# Altium schematic sheet COMM Circuitry.SchDoc
size A4; SheetNumber: 5; SheetTotal: 6
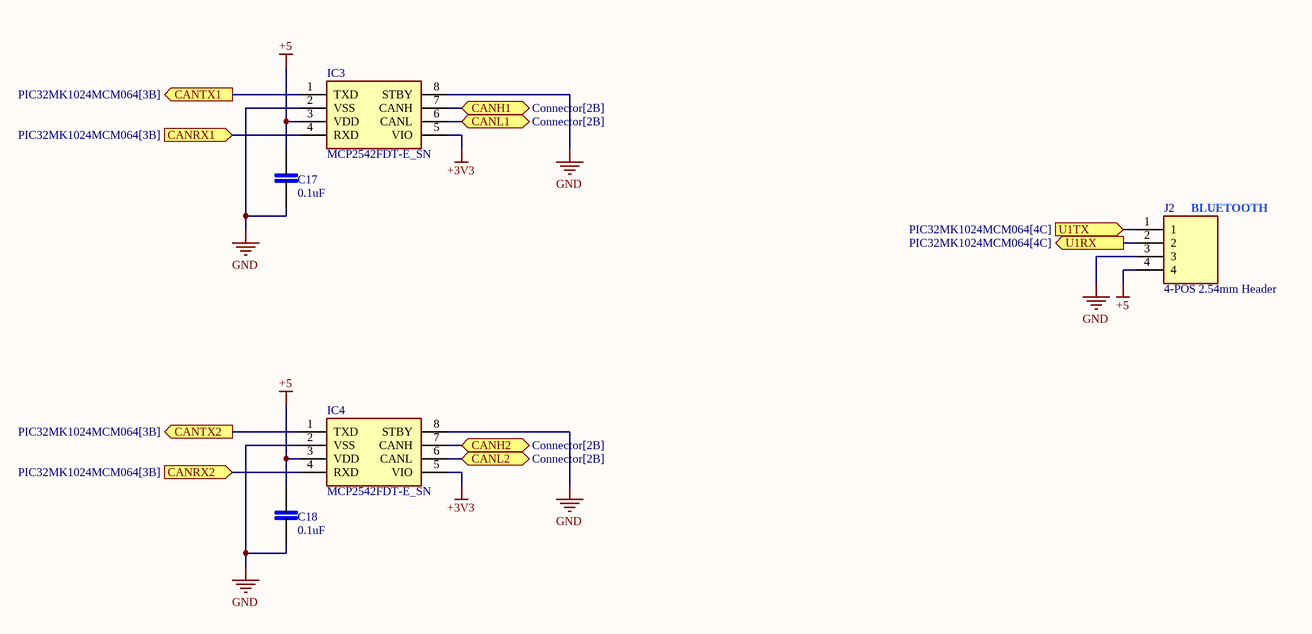
[diagram p0: COMM Circuitry.SchDoc]

## Parts
C17  0.1uF  [0805]
C18  0.1uF  [0805]
IC3  MCP2542FDT-E_SN  [MCP2542FDT-E_SN]
IC4  MCP2542FDT-E_SN  [MCP2542FDT-E_SN]
J2  4-POS 2.54mm Header  [4-POS 2.54mm Header]

## Ports
CANH1 (bidir, see Connector[2B]), CANH2 (bidir, see Connector[2B]), CANL1 (bidir, see Connector[2B]), CANL2 (bidir, see Connector[2B]), CANRX1 (in, see PIC32MK1024MCM064[3B]), CANRX2 (in, see PIC32MK1024MCM064[3B]), CANTX1 (out, see PIC32MK1024MCM064[3B]), CANTX2 (out, see PIC32MK1024MCM064[3B]), U1RX (out, see PIC32MK1024MCM064[4C]), U1TX (in, see PIC32MK1024MCM064[4C])

## Nets
+3V3: IC3.5(VIO) IC4.5(VIO)
+5: C17.2 C18.2 IC3.3(VDD) IC4.3(VDD) J2.4
GND: C17.1 C18.1 IC3.2(VSS) IC3.8(STBY) IC4.2(VSS) IC4.8(STBY) J2.3
CANH1: IC3.7(CANH) ; port CANH1
CANH2: IC4.7(CANH) ; port CANH2
CANL1: IC3.6(CANL) ; port CANL1
CANL2: IC4.6(CANL) ; port CANL2
CANRX1: IC3.4(RXD) ; port CANRX1
CANRX2: IC4.4(RXD) ; port CANRX2
CANTX1: IC3.1(TXD) ; port CANTX1
CANTX2: IC4.1(TXD) ; port CANTX2
U1RX: J2.2 ; port U1RX
U1TX: J2.1 ; port U1TX

## Notes on the sheet
- (near J2) BLUETOOTH

## Library data of the parts
C17 C18 = 0805_Capacitor: MP: LD051A121KAB2A; MF: AVX; SnapEDA_Link: https://www.snapeda.com/parts/LD051A121KAB2A/AVX/view-part/?ref=snap; Package: 0805 AVX; Check_prices: https://www.snapeda.com/parts/LD051A121KAB2A/AVX/view-part/?ref=eda; Purchase-URL: https://pricing.snapeda.com/search/part/LD051A121KAB2A/?ref=eda; Price: None; Value: *; Availability: In Stock
IC3 IC4 = MCP2542FDT-E_SN: Integrated Circuit; Manufacturer_Name: Microchip; Manufacturer_Part_Number: MCP2542FDT-E/SN; Datasheet Link: https://ww1.microchip.com/downloads/en/DeviceDoc/MCP2542FD-MCP2542WFD-4WFD-Data-Sheet-DS20005514C.pdf; Height: 1.75mm; Mouser Part Number: 579-MCP2542FDT-E/SN; Mouser Price/Stock: https://www.mouser.co.uk/ProductDetail/Microchip-Technology/MCP2542FDT-E-SN?qs=qdgZG5p0FZ7dgTYBMrlrQQ%3D%3D; Arrow Part Number: MCP2542FDT-E/SN; Arrow Price/Stock: https://www.arrow.com/en/products/mcp2542fdt-esn/microchip-technology?region=nac
J2 = 4-POS 2.54mm Header: MP: 5-146290-4; Package: None; Price: None; Value: *; Availability: Unavailable